# EAGLE design Rocketometer2148 MPU6050 (EAGLE 6.2)
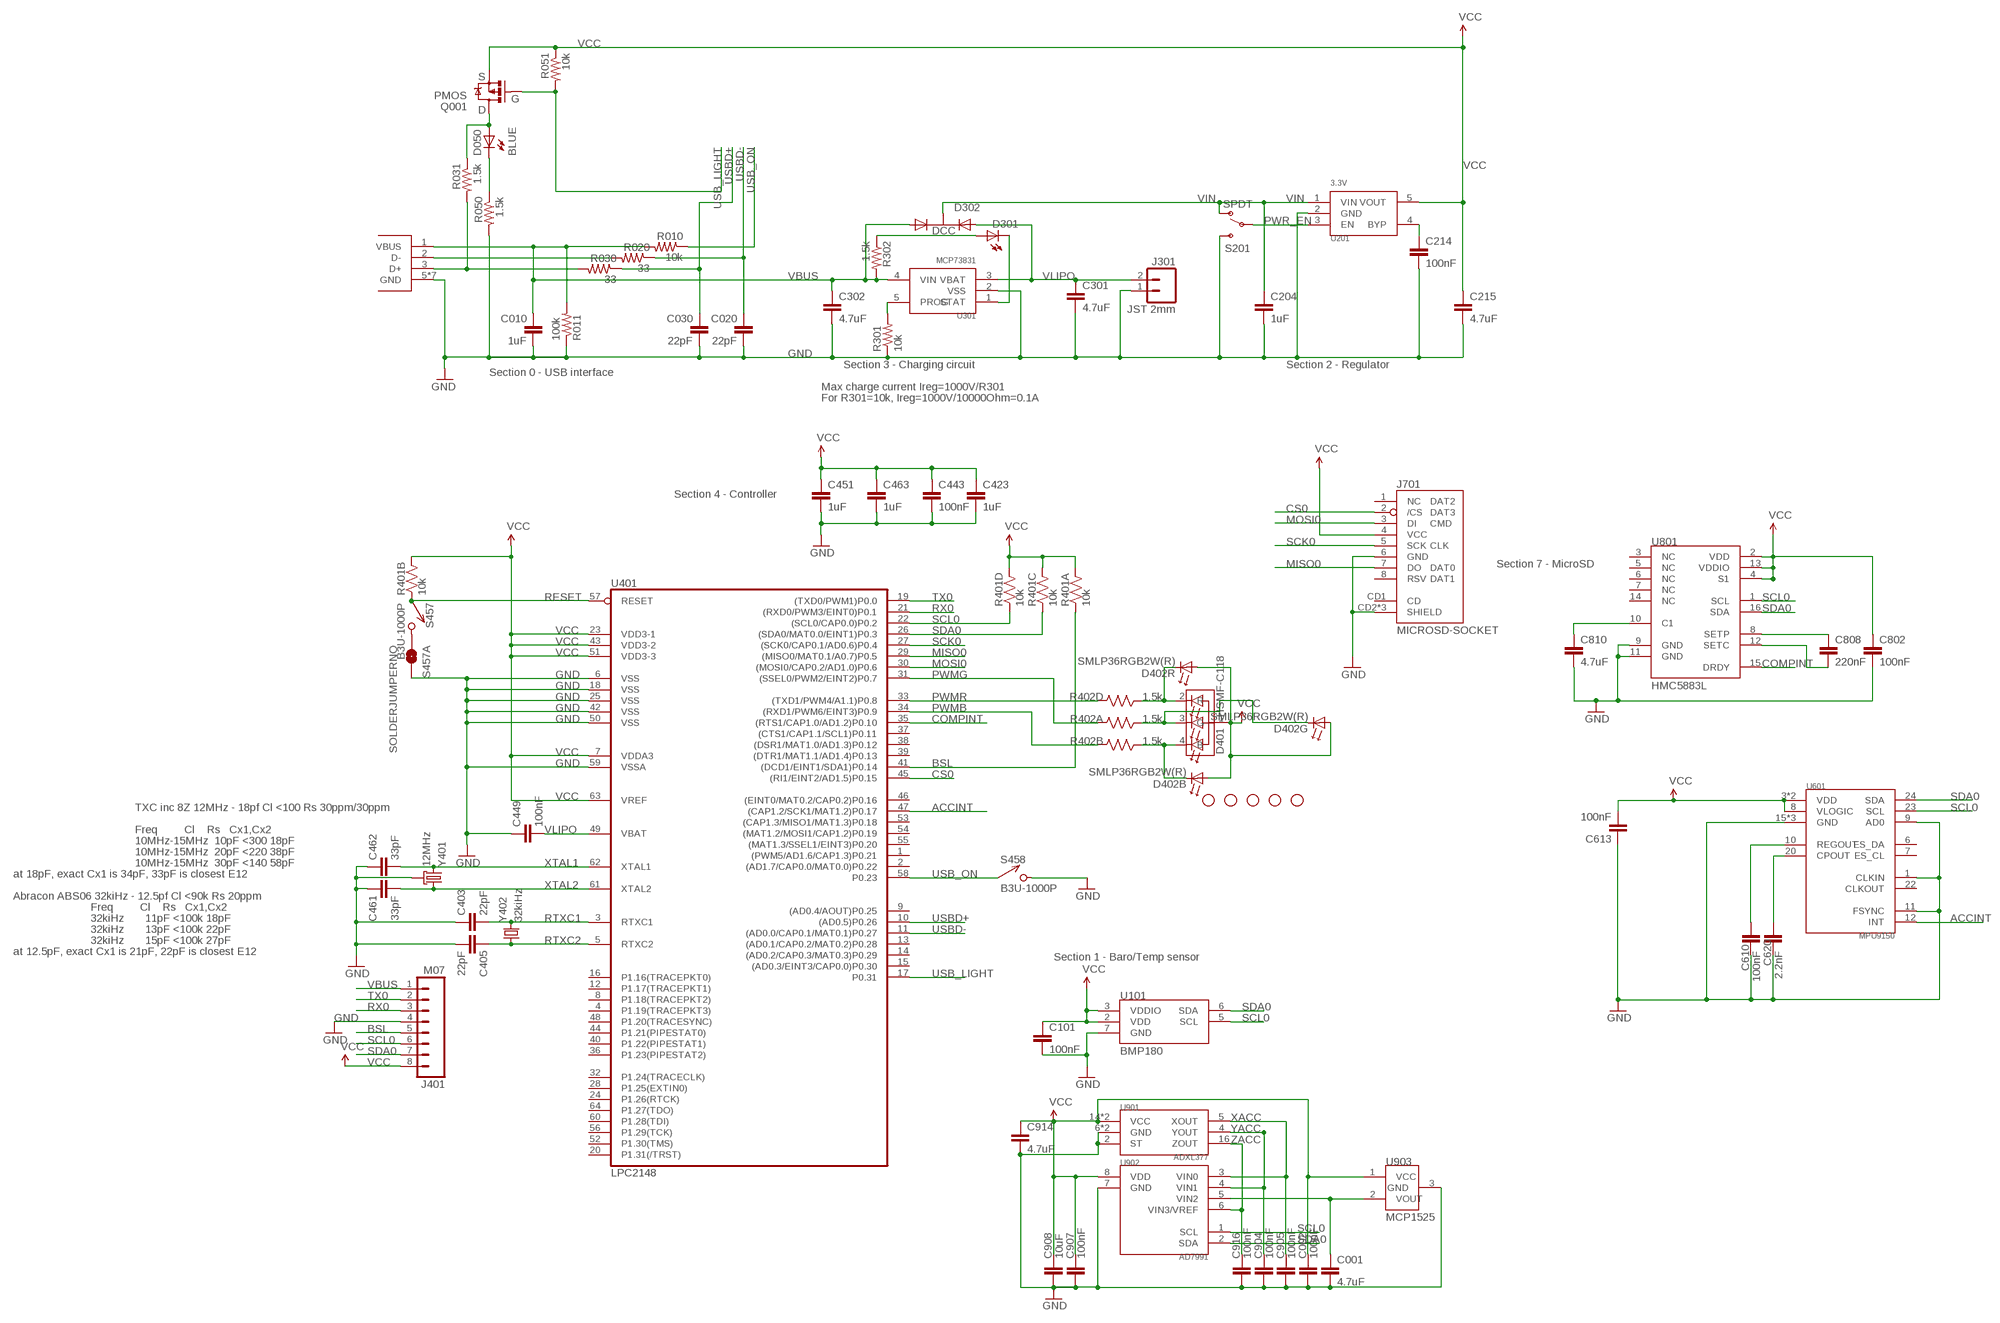
[diagram p0: schematic, sheet 1]

## Parts
C001  4.7uF  CAP0402-CAP  [0402-CAP]
C002  100nF  CAP0402-CAP  [0402-CAP]
C010  1uF  CAP0402-CAP  [0402-CAP]
C020  22pF  CAP0402-CAP  [0402-CAP]
C030  22pF  CAP0402-CAP  [0402-CAP]
C101  100nF  CAP0402-CAP  [0402-CAP]
C204  1uF  CAP0402-CAP  [0402-CAP]
C214  100nF  CAP0402-CAP  [0402-CAP]
C215  4.7uF  CAP0402-CAP  [0402-CAP]
C301  4.7uF  CAP0402-CAP  [0402-CAP]
C302  4.7uF  CAP0402-CAP  [0402-CAP]
C403  22pF  CAP0402-CAP  [0402-CAP]
C405  22pF  CAP0402-CAP  [0402-CAP]
C423  1uF  CAP0402-CAP  [0402-CAP]
C443  100nF  CAP0402-CAP  [0402-CAP]
C449  100nF  CAP0402-CAP  [0402-CAP]
C451  1uF  CAP0402-CAP  [0402-CAP]
C461  33pF  CAP0402-CAP  [0402-CAP]
C462  33pF  CAP0402-CAP  [0402-CAP]
C463  1uF  CAP0402-CAP  [0402-CAP]
C610  100nF  CAP0402-CAP  [0402-CAP]
C613  100nF  CAP0402-CAP  [0402-CAP]
C620  2.2nF  CAP0402-CAP  [0402-CAP]
C802  100nF  CAP0402-CAP  [0402-CAP]
C808  220nF  CAP0402-CAP  [0402-CAP]
C810  4.7uF  CAP0402-CAP  [0402-CAP]
C904  100nF  CAP0402-CAP  [0402-CAP]
C905  100nF  CAP0402-CAP  [0402-CAP]
C907  100nF  CAP0402-CAP  [0402-CAP]
C908  10uF  CAP0603-CAP  [0603-CAP]
C914  4.7uF  CAP0402-CAP  [0402-CAP]
C916  100nF  CAP0402-CAP  [0402-CAP]
D050  BLUE  LED0603  [LED-0603]
D301  YELLOW  LED0603  [LED-0603]
D302  DCC  PMEG2005CT  [SOT-23-3]
D401  HSMF-C118  [HSMF-C118]
D402  SMLP36RGB2W(R)  [SMLP36]
J001  USB_MICROB_JST  [UB-MC5BR3-SD204-4S]
J301  JST 2mm  M02-JST-2MM-SMT  [JST-2-SMD]
J401  M07  M081X08  [1X08]
J701  MICROSD-SOCKET  [MICROSD-SOCKET-PP]
JP1  STAND-OFFTIGHT  [STAND-OFF-TIGHT]
JP2  STAND-OFFTIGHT  [STAND-OFF-TIGHT]
JP3  STAND-OFFTIGHT  [STAND-OFF-TIGHT]
JP4  STAND-OFFTIGHT  [STAND-OFF-TIGHT]
JP5  STAND-OFFTIGHT  [STAND-OFF-TIGHT]
Q001  PMOS  MOSFET-PCHANNELSMD  [SOT23-3]
R010  10k  RESISTOR0402-RES  [0402-RES]
R011  100k  RESISTOR0402-RES  [0402-RES]
R020  33  RESISTOR0402-RES  [0402-RES]
R030  33  RESISTOR0402-RES  [0402-RES]
R031  1.5k  RESISTOR0402-RES  [0402-RES]
R050  1.5k  RESISTOR0402-RES  [0402-RES]
R051  10k  RESISTOR0402-RES  [0402-RES]
R301  10k  RESISTOR0402-RES  [0402-RES]
R302  1.5k  RESISTOR0402-RES  [0402-RES]
R401  10k  RP404  [CRA04]
R402  1.5k  RP404  [CRA04]
S201  SPDT  SWITCH-SPSTSMD  [AYZ0202]
S457  B3U-1000P  [B3U-1000P]
S457A  SOLDERJUMPERNO  [SJ_2S-NO]
S458  B3U-1000P  [B3U-1000P]
U101  BMP180  [BMP180]
U201  3.3V  MIC5319D5  [SOT-23-5]
U301  MCP73831  [SOT-23-5]
U401  LPC2148  LPC213X  [SQFP-S-10X10-64]
U601  MPU9150  [LLGA24]
U801  HMC5883L  HMC5883LSMD  [16LPCC]
U901  ADXL377  [ADXL377]
U902  AD7991  AD799X  [SOT-23-8]
U903  MCP1525  [SOT-23-3]
Y401  12MHz  CX2520  [CRYSTAL_SMD_2MM_2_5MM]
Y402  32kiHz  ABS06  [ABS06]

## Nets
ACCINT: U401.47((CAP1.2/SCK1/MAT1.2)P0.17) U601.12(INT)
BSL: J401.5 R401.1 U401.41((DCD1/EINT1/SDA1)P0.14)
COMPINT: U401.35((RTS1/CAP1.0/AD1.2)P0.10) U801.15(DRDY)
CONN_D+: J001.3(D+) R030.2 R031.2
CONN_D-: J001.2(D-) R020.2
CS0: J701.2(/CS) U401.45((RI1/EINT2/AD1.5)P0.15)
GND [power]: C001.2 C002.2 C010.2 C020.2 C030.2 C101.2 C204.2 C214.2 C215.2 C301.2 C302.2 C403.1 C405.2 C423.2 C443.2 C449.1 C451.2 C461.1 C462.1 C463.2 C610.2 C613.1 C620.1 C802.2 C810.2 C904.2 C905.2 C907.2 C908.2 C914.2 C916.2 J001.5(GND) J001.P$6(GND) J001.P$7(GND) J001.P$8(GND) J001.P$9(GND) J001.P$10(GND) J001.P$11(GND) J301.1 J401.4 J701.6(GND) J701.CD2(SHIELD) J701.GND1(SHIELD) J701.GND3(SHIELD) R011.1 R050.2 R301.1 S201.3(S) S457A.2 S458.P$2 U101.7(GND) U201.2(GND) U301.2(VSS) U401.6(VSS) U401.18(VSS) U401.25(VSS) U401.42(VSS) U401.50(VSS) U401.59(VSSA) U601.1(CLKIN) U601.9(AD0) U601.11(FSYNC) U601.15(GND) U601.17(GND) U601.18(GND) U801.9(GND) U801.11(GND) U901.2(ST) U901.6(GND) U901.7(GND) U902.7(GND) U903.3(GND) Y401.2(GND) Y401.4(GND)
MISO0: J701.7(DO) U401.29((MISO0/MAT0.1/A0.7)P0.5)
MOSI0: J701.3(DI) U401.30((MOSI0/CAP0.2/AD1.0)P0.6)
N$1: C620.2 U601.20(CPOUT)
N$2: R301.2 U301.5(PROG)
N$4: D301.C U301.1(STAT)
N$5: D301.A R302.1
N$6: D050.A Q001.3(D) R031.1
N$7: D050.C R050.1
N$8: S457.P$2 S457A.1
N$10: C001.1 U902.5(VIN2) U903.2(VOUT)
N$13: C610.1 U601.10(REGOUT)
N$14: C808.1 U801.8(SETP)
N$15: C808.2 U801.12(SETC)
N$16: C810.1 U801.10(C1)
N$17: C214.1 U201.4(BYP)
PWMB: R402.7 U401.34((RXD1/PWM6/EINT3)P0.9)
PWMG: R402.8 U401.31((SSEL0/PWM2/EINT2)P0.7)
PWMR: R402.5 U401.33((TXD1/PWM4/A1.1)P0.8)
PWR_EN: S201.2(P) U201.3(EN)
QWMB: D401.4(B) D402.1(B:C) R402.2
QWMG: D401.3(G) D402.5(G:C) R402.1
QWMR: D401.2(R) D402.3(R:C) R402.4
RESET [power]: R401.2 S457.P$1 U401.57(RESET)
RTXC1: C403.2 U401.3(RTXC1) Y402.2
RTXC2: C405.1 U401.5(RTXC2) Y402.1
RX0: J401.3 U401.21((RXD0/PWM3/EINT0)P0.1)
SCK0: J701.5(SCK) U401.27((SCK0/CAP0.1/AD0.6)P0.4)
SCL0: J401.6 R401.4 U101.5(SCL) U401.22((SCL0/CAP0.0)P0.2) U601.23(SCL) U801.1(SCL) U902.1(SCL)
SDA0: J401.7 R401.3 U101.6(SDA) U401.26((SDA0/MAT0.0/EINT1)P0.3) U601.24(SDA) U801.16(SDA) U902.2(SDA)
TX0: J401.2 U401.19((TXD0/PWM1)P0.0)
USB_LIGHT: Q001.1(G) R051.2 U401.17(P0.31)
USB_ON: R010.1 S458.P$1 U401.58(P0.23)
USBD+: C030.1 R030.1 U401.10((AD0.5)P0.26)
USBD-: C020.1 R020.1 U401.11((AD0.0/CAP0.1/MAT0.1)P0.27)
VBUS: C010.1 C302.1 D302.1(A1) J001.1(VBUS) J401.1 R010.2 R011.2 R302.2 U301.4(VIN)
VCC [power]: C002.1 C101.1 C215.1 C423.1 C443.1 C451.1 C463.1 C613.2 C802.1 C907.1 C908.1 C914.1 D401.1(A) D402.2(B:A) D402.4(R:A) D402.6(G:A) J401.8 J701.4(VCC) Q001.2(S) R051.1 R401.5 R401.6 R401.7 R401.8 U101.2(VDD) U101.3(VDDIO) U201.5(VOUT) U401.7(VDDA3) U401.23(VDD3-1) U401.43(VDD3-2) U401.51(VDD3-3) U401.63(VREF) U601.3(VDD) U601.8(VLOGIC) U601.13(VDD) U801.2(VDD) U801.4(S1) U801.13(VDDIO) U901.14(VCC) U901.15(VCC) U902.8(VDD) U903.1(VCC)
VIN: C204.1 D302.3(K) S201.1(O) U201.1(VIN)
VLIPO: C301.1 C449.2 D302.2(A2) J301.2 U301.3(VBAT) U401.49(VBAT)
XACC: C905.1 U901.5(XOUT) U902.3(VIN0)
XTAL1: C462.2 U401.62(XTAL1) Y401.3
XTAL2: C461.2 U401.61(XTAL2) Y401.1
YACC: C904.1 U901.4(YOUT) U902.4(VIN1)
ZACC: C916.1 U901.16(ZOUT) U902.6(VIN3/VREF)
Unconnected: J701.1(NC) J701.8(RSV) J701.CD1(CD) R402.3 R402.6 U401.1((PWM5/AD1.6/CAP1.3)P0.21) U401.2((AD1.7/CAP0.0/MAT0.0)P0.22) U401.4(P1.19(TRACEPKT3)) U401.8(P1.18(TRACEPKT2)) U401.9((AD0.4/AOUT)P0.25) U401.12(P1.17(TRACEPKT1)) U401.13((AD0.1/CAP0.2/MAT0.2)P0.28) U401.14((AD0.2/CAP0.3/MAT0.3)P0.29) U401.15((AD0.3/EINT3/CAP0.0)P0.30) U401.16(P1.16(TRACEPKT0)) U401.20(P1.31(/TRST)) U401.24(P1.26(RTCK)) U401.28(P1.25(EXTIN0)) U401.32(P1.24(TRACECLK)) U401.36(P1.23(PIPESTAT2)) U401.37((CTS1/CAP1.1/SCL1)P0.11) U401.38((DSR1/MAT1.0/AD1.3)P0.12) U401.39((DTR1/MAT1.1/AD1.4)P0.13) U401.40(P1.22(PIPESTAT1)) U401.44(P1.21(PIPESTAT0)) U401.46((EINT0/MAT0.2/CAP0.2)P0.16) U401.48(P1.20(TRACESYNC)) U401.52(P1.30(TMS)) U401.53((CAP1.3/MISO1/MAT1.3)P0.18) U401.54((MAT1.2/MOSI1/CAP1.2)P0.19) U401.55((MAT1.3/SSEL1/EINT3)P0.20) U401.56(P1.29(TCK)) U401.60(P1.28(TDI)) U401.64(P1.27(TDO)) U601.6(ES_DA) U601.7(ES_CL) U601.22(CLKOUT) U801.3(NC) U801.5(NC) U801.6(NC) U801.7(NC) U801.14(NC)

## Notes on the sheet
- S
- G
- D
- Section 0 - USB interface | Section 3 - Charging circuit | Section 2 - Regulator
- Max charge current Ireg=1000V/R301
- For R301=10k, Ireg=1000V/10000Ohm=0.1A
- Section 4 - Controller
- Section 7 - MicroSD
- TXC inc 8Z 12MHz - 18pf Cl <100 Rs 30ppm/30ppm
- Freq         Cl    Rs   Cx1,Cx2
- 10MHz-15MHz  10pF <300 18pF
- 10MHz-15MHz  20pF <220 38pF
- 10MHz-15MHz  30pF <140 58pF
- at 18pF, exact Cx1 is 34pF, 33pF is closest E12
- Abracon ABS06 32kiHz - 12.5pf Cl <90k Rs 20ppm
- Freq         Cl    Rs   Cx1,Cx2
- 32kiHz       11pF <100k 18pF
- 32kiHz       13pF <100k 22pF
- 32kiHz       15pF <100k 27pF
- at 12.5pF, exact Cx1 is 21pF, 22pF is closest E12
- Section 1 - Baro/Temp sensor

## Library data of the parts
C001 C215 C301 C302 C810 C914 = SparkFun:CAP: Capacitor Standard 0603 ceramic capacitor, and 0.1" leaded capacitor.; DIGIKEY: 445-7395-1-ND
C002 C907 = SparkFun-Passives:CAP: Capacitor Standard 0603 ceramic capacitor, and 0.1" leaded capacitor.; DIGIKEY: 445-1265-1-ND
C010 C204 C423 C451 C463 = SparkFun:CAP: Capacitor Standard 0603 ceramic capacitor, and 0.1" leaded capacitor.; DIGIKEY: 445-4114-1-ND
C020 C030 C403 C405 = SparkFun:CAP: Capacitor Standard 0603 ceramic capacitor, and 0.1" leaded capacitor.; DIGIKEY: 445-1239-1-ND
C101 C214 C443 C449 C610 C613 C802 C904 C905 C916 = SparkFun:CAP: Capacitor Standard 0603 ceramic capacitor, and 0.1" leaded capacitor.; DIGIKEY: 445-1265-1-ND
C461 C462 = SparkFun:CAP: Capacitor Standard 0603 ceramic capacitor, and 0.1" leaded capacitor.; DIGIKEY: 445-1241-1-ND
C620 = SparkFun:CAP: Capacitor Standard 0603 ceramic capacitor, and 0.1" leaded capacitor.; DIGIKEY: 445-1257-1-ND
C808 = SparkFun:CAP: Capacitor Standard 0603 ceramic capacitor, and 0.1" leaded capacitor.; DIGIKEY: 445-5938-1-ND
C908 = SparkFun:CAP: Capacitor Standard 0603 ceramic capacitor, and 0.1" leaded capacitor.; DIGIKEY: 445-7486-1-ND
D050 = SparkFun:LED: LEDs Standard schematic elements and footprints for 5mm, 3mm, 1206, and 0603 sized LEDs. 5mm - Spark Fun Electronics SKU : COM-00529 (and others); DIGIKEY: 350-2037-1-ND
D301 = SparkFun:LED: LEDs Standard schematic elements and footprints for 5mm, 3mm, 1206, and 0603 sized LEDs. 5mm - Spark Fun Electronics SKU : COM-00529 (and others); DIGIKEY: 350-2032-1-ND
D302 = KwanSystems:PMEG2005CT; DIGIKEY: 568-6500-1-ND
D401 = KwanSystems:HSMF-C118; DIGIKEY: 516-1778-1-ND
D402 = KwanSystems:SMLP36RGB2W(R)
J001 = KwanSystems:USB_MICROB_JST; DIGIKEY: 455-2562-1-ND
J301 = SparkFun:M02: Header 2 Standard 2-pin 0.1" header. Use with straight break away headers (SKU : PRT-00116), right angle break away headers (PRT-00553), swiss pins (PRT-00743), machine pins (PRT-00117), and female headers (PRT-00115). Molex polarized connector foot print use with SKU : PRT-08233 with associated crimp pins and housings.; DIGIKEY: 455-1749-1-ND
J401 = SparkFun-Connectors:M08: Header 8 Standard 8-pin 0.1" header. Use with straight break away headers (SKU : PRT-00116), right angle break away headers (PRT-00553), swiss pins (PRT-00743), machine pins (PRT-00117), and female headers (PRT-00115).; DIGIKEY: $NOPART
J701 = KwanSystems:MICROSD-SOCKET: microSD Socket Push-push type uSD socket. Digikey 101-00660-68-6-1-ND. tDoc lines correctly indicate media card edge positions when inserting (unlocked, locked, depressed).; DIGIKEY: 101-00581-59-1-ND
JP1-JP5 = SparkFun-Electromechanical:STAND-OFF: #4 Stand Off This is the mechanical footprint for a #4 phillips button head screw. Use the keepout ring to avoid running the screw head into surrounding components. SKU : PRT-00447; DIGIKEY: $NOPART
Q001 = SparkFun-DiscreteSemi:MOSFET-PCHANNEL: Generic PMOSFET
R010 R051 R301 = SparkFun:RESISTOR: Resistor Basic schematic elements and footprints for 0603, 1206, and PTH resistors.; DIGIKEY: P10.0KLCT-ND
R011 = SparkFun:RESISTOR: Resistor Basic schematic elements and footprints for 0603, 1206, and PTH resistors.; DIGIKEY: P100KLCT-ND
R020 R030 = SparkFun:RESISTOR: Resistor Basic schematic elements and footprints for 0603, 1206, and PTH resistors.; DIGIKEY: P33.0LCT-ND
R031 R050 R302 = SparkFun:RESISTOR: Resistor Basic schematic elements and footprints for 0603, 1206, and PTH resistors.; DIGIKEY: P1.50KLCT-ND
R401 = KwanSystems:RP4; DIGIKEY: CRA4S810KCT-ND
R402 = KwanSystems:RP4; DIGIKEY: CRA4S81.5KCT-ND
S201 = SparkFun:SWITCH-SPST: SPST Switch Simple slide switch. Spark Fun Electronics SKU : COM-00102; DIGIKEY: 401-2013-1-ND
S457 S458 = KwanSystems:B3U-1000P; DIGIKEY: SW1020CT-ND
S457A = SparkFun-Passives:SOLDERJUMPER: Solder Jumper Standard SMD solder jumper. Used to automate production. Two varients : Normally Open and Normally Closed are the same, but have different paste layers. NC will have a large amount of paste and should jumper during reflow.; DIGIKEY: $NOPART
U101 = KwanSystems:BMP180; DIGIKEY: 828-1027-1-ND
U201 = KwanSystems:MIC5319; DIGIKEY: 576-1910-1-ND
U301 = KwanSystems:MCP73831; DIGIKEY: 576-1910-1-ND
U401 = SparkFun:LPC213X: LPC213x Schematic element and footprint for NXP LPC213x. Spark Fun Electronics SKU : COM-00520; DIGIKEY: 568-1765-ND
U601 = KwanSystems:MPU9150
U801 = SparkFun:HMC5883L: 3 Axis Digital Compass IC; DIGIKEY: 342-1082-1-ND; LABEL_3D50: 5883
U901 = KwanSystems:ADXL377; DIGIKEY: ADXL377BCPZ-RL7CT-ND
U902 = KwanSystems:AD799X; DIGIKEY: AD7991YRJZ-0500RL7CT-ND
U903 = KwanSystems:MCP1525
Y401 = KwanSystems:CX2520; DIGIKEY: 887-1487-1-ND
Y402 = KwanSystems:ABS06; DIGIKEY: 535-10104-1-ND

## Net classes
0 default: width 0.152 mm, drill 0.33 mm, clearance 0.152 mm
1 power: width 0.152 mm, drill 0.33 mm, clearance 0.152 mm to class 0, clearance 0.152 mm
2 hv: width 0.152 mm, drill 0.33 mm, clearance 0.152 mm to class 0, clearance 0.152 mm to class 1, clearance 0.152 mm

## Board
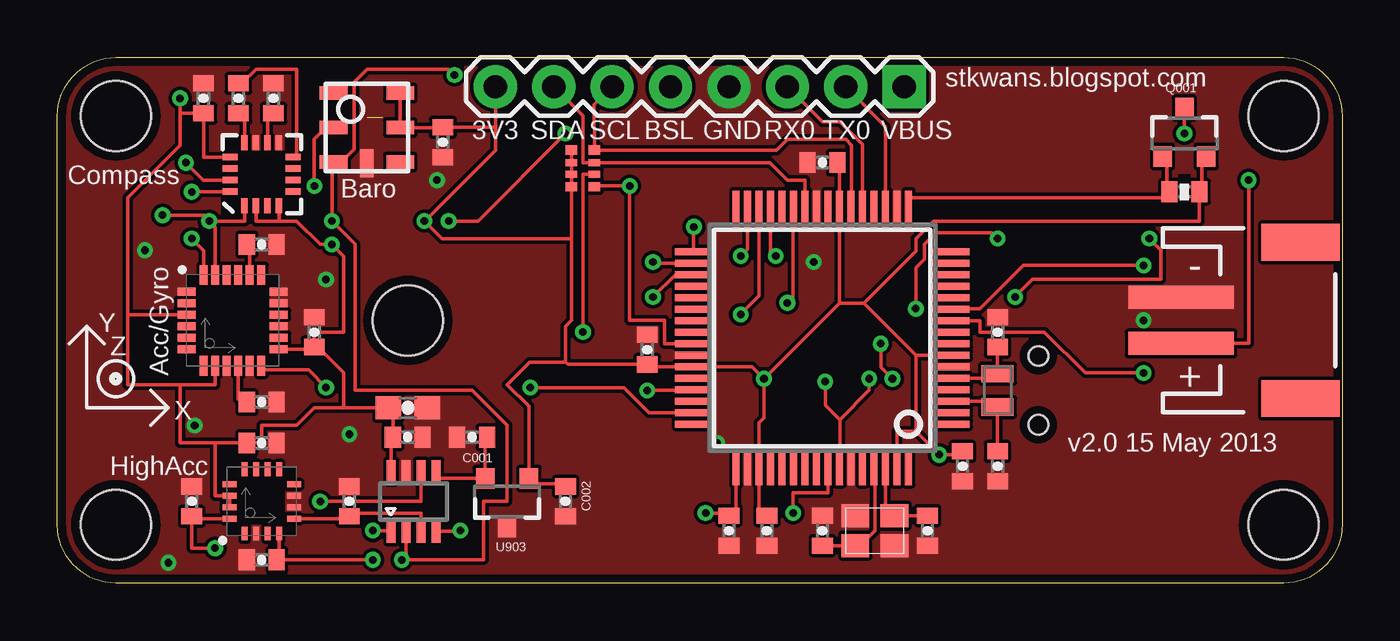
[diagram p1: board, top side]
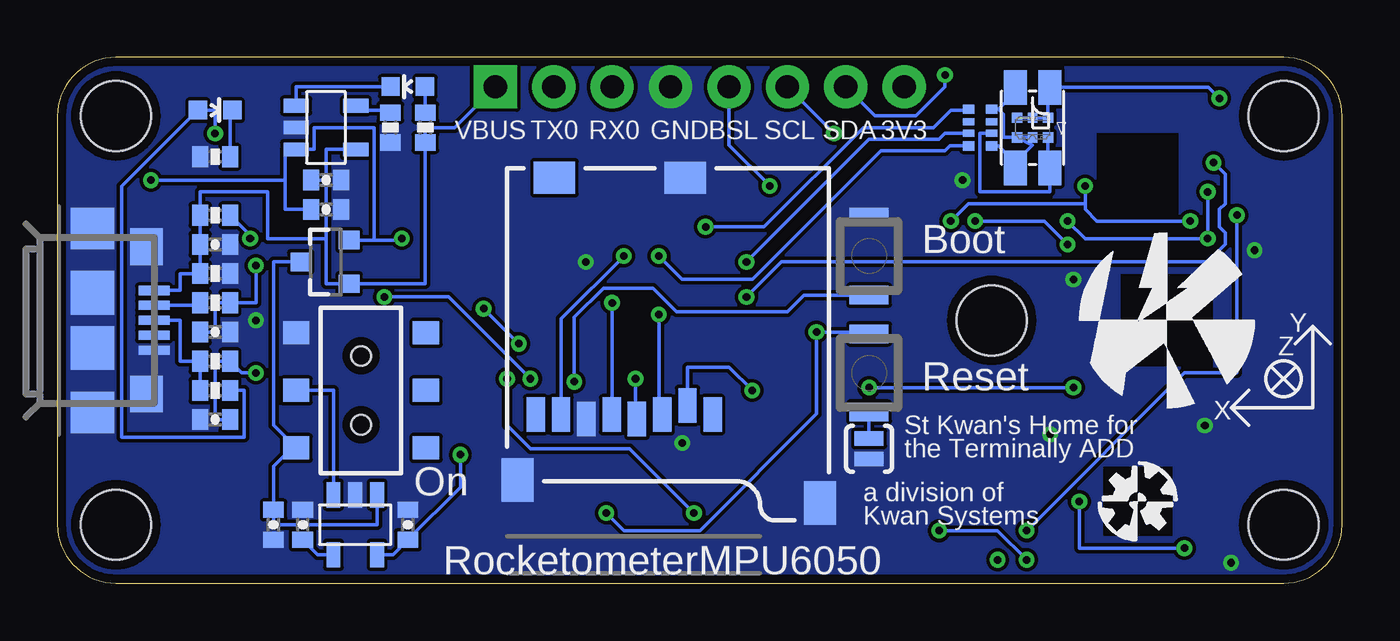
[diagram p2: board, bottom side, seen from below]

Size 55.88 x 22.86 mm. Coordinates in mm from the lower left corner, seen from the top.
Outline: 2.54,22.86 53.34,22.86 arc-90 55.88,20.32 55.88,2.54 arc-90 53.34,0 2.54,0 arc-90 0,2.54 0,20.32 arc-90 2.54,22.86
Copper layers (1*16): Top 0.0356mm / dielectric 1.5011mm / Bottom 0.0356mm
Design rules: minimum track width 6mil, minimum drill 13mil, track to track 6mil, track to pad 6mil, pad to pad 6mil, via to via 6mil, smd to smd 6mil, copper to edge 15mil, drill to drill 6mil, minimum pad ring 7mil, minimum via ring 7mil, stop-mask expansion 4mil, vias tented up to drill 14mil, thermal gap 10mil
tRestrict: area 7.9,16.8 to 9.9,18.8; area 9.9,18.8 to 10.7,19.6; area 9.9,16 to 10.7,16.8; area 7.1,18.8 to 7.9,19.6; area 7.1,16 to 7.9,16.8; area 48.8,17.5 to 49.3,17.8
bRestrict: area 7.1,16 to 10.7,19.6

### Footprints (pad centres in the part's own frame; a part is rotated, then mirrored left to right if it is on the bottom)
0402-CAP = smd 0.7 x 0.9: 1 -0.65,0; 2 0.65,0
0603-CAP = smd 1.1 x 1: 1 -0.85,0; 2 0.85,0
LED-0603 = smd 0.8 x 0.8: A 0,-0.75; C 0,0.75
SOT-23-3 = smd 0.9 x 0.8: 1 -1,0.95; 2 -1,-0.95; 3 1.1,0
HSMF-C118 = smd 1.5 x 1: 1 1.75,-0.75; 2 1.75,0.75; 3 -1.75,0.75; 4 -1.75,-0.75
SMLP36 = smd 0.45 x 0.45: 1 -0.675,0.425; 2 -0.675,-0.425; 5 0.675,0.425; 6 0.675,-0.425 | smd 0.4 x 0.45: 3 0,0.425; 4 0,-0.425
UB-MC5BR3-SD204-4S = smd 0.4 x 1.35: 1 -1.3,2.675; 2 -0.65,2.675; 3 0,2.675; 4 0.65,2.675; 5 1.3,2.675 | smd 1.8 x 1.9: P$6 4,0; P$7 -4,0 | smd 1.9 x 1.9: P$8 -1.2,0; P$9 1.2,0 | smd 1.6 x 1.4: P$10 -3.2,2.35; P$11 3.2,2.35
JST-2-SMD = smd 1 x 4.6: 1 -1,-3.7; 2 1,-3.7 | smd 1.6 x 3.4: NC1 -3.4,1.5; NC2 3.4,1.5
1X08 = drill 1.016 pad 1.88 square: 1 0,0 | drill 1.016 pad 1.88: 2 2.54,0; 3 5.08,0; 4 7.62,0; 5 10.16,0; 6 12.7,0; 7 15.24,0; 8 17.78,0
MICROSD-SOCKET-PP = smd 0.8 x 1.5: 1 -8.94,10.7; 2 -7.84,10.3; 3 -6.74,10.7; 4 -5.64,10.9; 5 -4.54,10.7; 6 -3.44,10.9; 7 -2.34,10.7; 8 -1.24,10.7 | smd 1.8 x 1.4: CD1 -2.05,0.4; CD2 -7.75,0.4 | smd 1.4 x 1.9: GND1 -13.6,14.55; GND3 -0.45,13.55
STAND-OFF-TIGHT = hole 3.048: 0,0
SOT23-3 = smd 0.8 x 0.9: 1 -0.95,-1; 2 0.95,-1; 3 0,1.1
0402-RES = smd 0.7 x 0.9: 1 -0.65,0; 2 0.65,0
CRA04 = smd 0.4 x 0.5: 1 -0.8,-0.5; 4 0.8,-0.5; 5 0.8,0.5; 8 -0.8,0.5 | smd 0.3 x 0.5: 2 -0.25,-0.5; 3 0.25,-0.5; 6 0.25,0.5; 7 -0.25,0.5
AYZ0202 = smd 1 x 1.15: 1 -2.5,2.825; 2 0,2.825; 3 2.5,2.825; 4 -2.5,-2.825; 5 0,-2.825; 6 2.5,-2.825 | hole 0.85: 1.5,0; -1.5,0
B3U-1000P = smd 0.8 x 1.7: P$1 -1.7,0; P$2 1.7,0
SJ_2S-NO = smd 0.635 x 1.27: 1 -0.45,0; 2 0.45,0
BMP180 = smd 0.6 x 1.2: 1 1.5,1.45; 2 0,1.45; 3 -1.5,1.45; 4 -1.5,-1.45; 5 0,-1.45; 6 1.5,-1.45 | smd 1.2 x 0.6: 7 1.55,0
SOT-23-5 = smd 0.6 x 1.1: 1 -0.95,-1.3; 2 0,-1.3; 3 0.95,-1.3; 4 0.95,1.3; 5 -0.95,1.3
SQFP-S-10X10-64 = smd 0.3 x 1.6: 1 -3.75,-5.6; 2 -3.25,-5.6; 3 -2.75,-5.6; 4 -2.25,-5.6; 5 -1.75,-5.6; 6 -1.25,-5.6; 7 -0.75,-5.6; 8 -0.25,-5.6; 9 0.25,-5.6; 10 0.75,-5.6; 11 1.25,-5.6; 12 1.75,-5.6; 13 2.25,-5.6; 14 2.75,-5.6; 15 3.25,-5.6; 16 3.75,-5.6; 33 3.75,5.6; 34 3.25,5.6; 35 2.75,5.6; 36 2.25,5.6; 37 1.75,5.6; 38 1.25,5.6; 39 0.75,5.6; 40 0.25,5.6; 41 -0.25,5.6; 42 -0.75,5.6; 43 -1.25,5.6; 44 -1.75,5.6; 45 -2.25,5.6; 46 -2.75,5.6; 47 -3.25,5.6; 48 -3.75,5.6 | smd 1.6 x 0.3: 17 5.6,-3.75; 18 5.6,-3.25; 19 5.6,-2.75; 20 5.6,-2.25; 21 5.6,-1.75; 22 5.6,-1.25; 23 5.6,-0.75; 24 5.6,-0.25; 25 5.6,0.25; 26 5.6,0.75; 27 5.6,1.25; 28 5.6,1.75; 29 5.6,2.25; 30 5.6,2.75; 31 5.6,3.25; 32 5.6,3.75; 49 -5.6,3.75; 50 -5.6,3.25; 51 -5.6,2.75; 52 -5.6,2.25; 53 -5.6,1.75; 54 -5.6,1.25; 55 -5.6,0.75; 56 -5.6,0.25; 57 -5.6,-0.25; 58 -5.6,-0.75; 59 -5.6,-1.25; 60 -5.6,-1.75; 61 -5.6,-2.25; 62 -5.6,-2.75; 63 -5.6,-3.25; 64 -5.6,-3.75
LLGA24 = smd 0.8 x 0.35: 1 -2,1.25; 2 -2,0.75; 3 -2,0.25; 4 -2,-0.25; 5 -2,-0.75; 6 -2,-1.25; 13 2,-1.25; 14 2,-0.75; 15 2,-0.25; 16 2,0.25; 17 2,0.75; 18 2,1.25 | smd 0.35 x 0.85: 7 -1.25,-1.975; 8 -0.75,-1.975; 9 -0.25,-1.975; 10 0.25,-1.975; 11 0.75,-1.975; 12 1.25,-1.975; 19 1.25,1.975; 20 0.75,1.975; 21 0.25,1.975; 22 -0.25,1.975; 23 -0.75,1.975; 24 -1.25,1.975
16LPCC = smd 0.65 x 0.28: 1 -1.37,0.75; 2 -1.37,0.25; 3 -1.37,-0.25; 4 -1.37,-0.75; 9 1.37,-0.75; 10 1.37,-0.25; 11 1.37,0.25; 12 1.37,0.75 | smd 0.28 x 0.65: 5 -0.75,-1.37; 6 -0.25,-1.37; 7 0.25,-1.37; 8 0.75,-1.37; 13 0.75,1.37; 14 0.25,1.37; 15 -0.25,1.37; 16 -0.75,1.37
ADXL377 = smd 0.6 x 0.25: 1 -1.4,0.75; 2 -1.4,0.25; 3 -1.4,-0.25; 4 -1.4,-0.75; 9 1.4,-0.75; 10 1.4,-0.25; 11 1.4,0.25; 12 1.4,0.75 | smd 0.25 x 0.6: 5 -0.75,-1.4; 6 -0.25,-1.4; 7 0.25,-1.4; 8 0.75,-1.4; 13 0.75,1.4; 14 0.25,1.4; 15 -0.25,1.4; 16 -0.75,1.4
SOT-23-8 = smd 0.4 x 1: 1 -0.975,-1.3; 2 -0.325,-1.3; 3 0.325,-1.3; 4 0.975,-1.3; 5 0.975,1.3; 6 0.325,1.3; 7 -0.325,1.3; 8 -0.975,1.3
CRYSTAL_SMD_2MM_2_5MM = smd 1.2 x 1: 1 -0.85,-0.65; 2 0.85,-0.65; 3 0.85,0.65; 4 -0.85,0.65
ABS06 = smd 0.75 x 1.4: 1 -0.725,0; 2 0.725,0

### Placement (x,y rotation side)
C001  18.03,6.35 180 top
C002  22.1,3.56 270 top
C010  49.02,14.73 0 bottom
C020  49.02,10.92 0 bottom
C030  49.02,7.11 180 bottom
C101  16.76,19.18 270 top
C204  46.48,2.54 270 bottom
C214  45.21,2.54 90 bottom
C215  40.64,2.54 90 bottom
C301  44.2,16.26 0 bottom
C302  44.2,17.53 0 bottom
C403  40.89,5.08 90 top
C405  40.89,10.92 90 top
C423  33.27,18.29 180 top
C443  25.65,10.16 90 top
C449  29.21,2.29 90 top
C451  30.86,2.29 270 top
C461  33.27,2.29 270 top
C462  37.85,2.29 90 top
C463  39.37,5.08 270 top
C610  8.89,7.87 0 top
C613  11.18,10.92 270 top
C620  8.89,14.73 180 top
C802  6.35,21.08 90 top
C808  7.87,21.08 270 top
C810  9.4,21.08 90 top
C904  8.89,1.02 180 top
C905  12.7,3.56 90 top
C907  15.24,6.35 0 top
C908  15.24,7.62 0 top
C914  8.89,6.1 0 top
C916  5.84,3.56 90 top
D050  49.02,20.57 270 bottom
D301  40.64,21.59 90 bottom
D302  44.2,13.97 180 bottom
D401  13.46,19.81 90 bottom
D402  13.46,19.81 180 bottom
J001  54.36,11.43 270 bottom
J301  52.58,11.43 270 top
J401  36.83,21.59 180 top
J701  36.31,18.03 180 bottom
JP1  2.54,2.54 0 top
JP2  2.54,20.32 0 top
JP3  15.24,11.43 0 top
JP4  53.34,2.54 0 top
JP5  53.34,20.32 0 top
Q001  49.02,19.56 0 top
R010  49.02,16 180 bottom
R011  49.02,13.46 180 bottom
R020  49.02,12.19 180 bottom
R030  49.02,9.65 180 bottom
R031  49.02,8.38 180 bottom
R050  49.02,18.54 180 bottom
R051  49.02,17.02 180 top
R301  41.4,19.81 90 bottom
R302  39.88,19.81 270 bottom
R401  22.86,18.03 90 top
R402  15.75,19.81 90 bottom
S201  42.67,8.38 90 bottom
S457  20.57,9.14 270 bottom
S457A  20.57,5.84 270 bottom
S458  20.57,14.22 90 bottom
U101  13.46,19.81 270 top
U201  42.93,2.54 180 bottom
U301  44.2,19.81 270 bottom
U401  33.27,10.67 90 top
U601  7.62,11.43 0 top
U801  8.89,17.78 90 top
U901  8.89,3.56 90 top
U902  15.49,3.56 0 top
U903  19.56,3.56 270 top
U$4  [AXES]  1.27,7.62 0 top
U$5  [KWAN_ACC]  7.62,11.43 0 bottom
U$6  [OSHW_ACC]  8.89,3.56 0 bottom
Y401  35.56,2.29 0 top
Y402  40.89,8.38 270 top

### Tracks (layer width: path | path; a pad name or v marks a point on that pad's centre or on a via)
ACCINT  (via drill 0.33)
  Top 0.152: U401.47 25.73,7.42 24.64,8.51 v20.57,8.51 | U601.12 8.87,9.27 10.92,9.27 v11.68,8.51
  Bottom 0.152: v20.57,8.51 v11.68,8.51
BSL  (via drill 0.33)
  Top 0.152: R401.1 23.37,17.27 v24.89,17.27 24.89,11.43 26.42,11.43 26.42,10.42 U401.41
  Bottom 0.152: J401.5 26.67,19.05 v24.89,17.27
COMPINT  (via drill 0.33)
  Top 0.152: U801.15 6.35,17.53 v5.59,18.29 | v25.91,12.45 26.88,13.42 U401.35
  Bottom 0.152: v5.59,18.29 5.08,17.78 5.08,16.51 5.33,16.26 5.33,15.49 5.08,15.24 5.08,14.73 5.84,13.97 24.38,13.97 v25.91,12.45
CONN_D+
  Bottom 0.152: J001.3 50.55,11.43 50.55,9.65 R030.2 R031.2
CONN_D-
  Bottom 0.152: J001.2 49.67,12.08 R020.2
CS0  (via drill 0.33)
  Top 0.152: U401.45 27.64,8.38 v25.65,8.38
  Bottom 0.152: v25.65,8.38 26.67,9.4 28.47,9.4 J701.2
GND  (via drill 0.33)
  other vias: 47.24,11.43 16.51,17.53 3.81,14.48 12.7,6.48 11.68,13.21 5.97,6.86 32.89,13.97 4.83,0.89 28.7,6.1
  pour Top (no thermals): 2.54,22.86 53.34,22.86 arc-90 55.88,20.32 55.88,2.54 arc-90 53.34,0 2.54,0 arc-90 0,2.54 0,20.32 arc-90
  pour Bottom (no thermals): 2.54,22.86 53.34,22.86 arc-90 55.88,20.32 55.88,2.54 arc-90 53.34,0 2.54,0 arc-90 0,2.54 0,20.32 arc-90
MISO0  (via drill 0.33)
  Top 0.152: U401.29 31.02,14.44 v31.24,14.22
  Bottom 0.152: v31.24,14.22 33.97,11.49 J701.7
MOSI0  (via drill 0.33)
  Top 0.152: U401.30 30.52,12.49 v29.72,11.68
  Bottom 0.152: J701.3 29.72,7.48 v29.72,11.68
N$1
  Top 0.152: U601.20 8.37,14.6 C620.2
N$2
  Bottom 0.152: U301.5 42.71,20.57 41.4,20.57 R301.2
N$4
  Bottom 0.152: D301.C 45.5,21.59 U301.1
N$5
  Bottom 0.152: D301.A 39.88,21.59 R302.1
N$6  (via drill 0.33)
  Top 0.152: Q001.3 v49.02,19.56
  Bottom 0.152: v49.02,19.56 49.02,20.57 D050.A 53.09,17.26 53.09,6.35 47.75,6.35 47.75,8.38 R031.1
N$7
  Bottom 0.152: D050.C arc-90 48.37,20.47 R050.1
N$8
  Bottom 0.152: S457.P$2 S457A.1
N$10
  Top 0.152: U902.5 16.47,4.56 U903.2 18.61,6.35 C001.1
N$13
  Top 0.152: C610.1 7.87,7.99 U601.10
N$14
  Top 0.152: C808.1 8.02,21.73 8.64,22.35 10.41,22.35 10.41,18.53 U801.8
N$15
  Top 0.152: U801.12 8.14,20.17 C808.2
N$16
  Top 0.152: U801.10 9.14,20.17 C810.1
N$17
  Bottom 0.152: U201.4 44.56,1.24 C214.1
PWMB  (via drill 0.33)
  Top 0.152: U401.34 25.96,13.92 v25.91,13.97
  Bottom 0.152: v25.91,13.97 20.57,19.3 17.53,19.3 17.27,19.56 R402.7
PWMG  (via drill 0.33)
  Top 0.152: v29.72,14.22 30.02,14.53 U401.31
  Bottom 0.152: R402.8 17.06,19.01 17.27,18.8 20.07,18.8 25.65,13.21 28.7,13.21 v29.72,14.22
PWMR  (via drill 0.33)
  Top 0.152: U401.33 27.67,15.49 v27.69,15.49
  Bottom 0.152: v27.69,15.49 25.15,15.49 20.83,19.81 17.78,19.81 17.02,20.57 16.26,20.57 R402.5
PWR_EN
  Bottom 0.152: U201.3 43.88,8.38 S201.2
QWMB
  Bottom 0.152: D402.1 12.79,18.54 12.95,18.54 12.95,18.3 D401.4 12.7,17.02 15.75,17.02 15.75,19.56 R402.2
QWMG
  Bottom 0.152: D402.5 13.46,19.05 14.21,18.3 D401.3 14.73,18.8 14.95,19.01 R402.1
QWMR
  Bottom 0.152: 15.23,20.57 R402.4 14.95,20.61 | 14.95,20.61 14.21,21.35 D401.2 | 14.95,20.61 14.73,20.4 14.73,19.39 D402.3
RESET  (via drill 0.33)
  Top 0.152: R401.2 22.86,17.78 v22.86,10.92 | U401.57 33.52,3.94 32,3.94 v32,3.05
  Bottom 0.152: S457.P$1 20.65,10.92 v22.86,10.92 22.86,7.37 27.94,2.29 31.24,2.29 v32,3.05
RTXC1
  Top 0.152: U401.3 40.63,7.92 Y402.2 C403.2
RTXC2
  Top 0.152: U401.5 40.7,8.92 Y402.1 C405.1
RX0
  Top 0.152: U401.21 35.02,19.08 34.04,20.07 33.27,20.07 J401.3
SCK0  (via drill 0.33)
  Top 0.152: U401.27 32,16.25 32,12.45 v31.75,12.19
  Bottom 0.152: v31.75,12.19 31.75,7.33 J701.5
SCL0  (via drill 0.33)
  Top 0.152: J401.6 23.34,20.8 R401.4 31.28,18.83 31.75,19.3 34.29,19.3 34.54,19.05 34.54,16.29 U401.22 | U101.5 11.68,19.81 11.18,19.3 v11.18,17.27 | v6.6,15.75 8.14,15.75 U801.1 | v22.1,19.56 18.29,15.75 v17.02,15.75 | U902.1 14.49,2.29 v13.72,2.29 | v6.6,15.75 6.87,15.48 U601.23 | v4.57,16 6.35,16 v6.6,15.75
  Bottom 0.152: J401.6 v22.1,19.56 | v6.6,15.75 10.67,15.75 11.18,16.26 11.18,16.51 | v13.72,2.29 6.86,9.14 4.57,9.14 v4.57,16 | 11.18,16.51 v11.18,17.27 | v17.02,15.75 16.26,16.51 11.18,16.51
SDA0  (via drill 0.33)
  Top 0.152: J401.7 22.86,20.32 22.86,18.29 23.34,18.29 R401.3 30.99,18.28 31.75,17.53 32.52,17.53 U401.26 | v17.27,22.1 17.02,22.35 13.46,22.35 12.9,21.79 12.9,18.87 12.34,18.31 U101.6 | U101.6 12.22,18.31 | v5.84,17.02 5.85,17.03 U801.16 | U902.2 15.17,1.2 v14.99,1.02 18.54,1.02 18.54,3.56 19.56,3.56 19.56,6.86 18.03,8.38 12.95,8.38 12.95,14.73 v11.94,15.75 11.94,18.31 U101.6 | U601.24 6.37,14.46 v5.84,14.99
  Bottom 0.152: J401.7 20.32,20.32 18.54,20.32 17.27,21.59 v17.27,22.1 | v11.94,15.75 11.18,14.99 v5.84,14.99 v5.84,17.02
TX0
  Top 0.152: U401.19 36.02,19.86 J401.2
USB_LIGHT
  Top 0.152: 48.26,18.56 48.26,17.02 R051.2 48.37,16.76 37.02,16.76 U401.17
  Top 0.406: 48.26,18.56 Q001.1
USB_ON  (via drill 0.33)
  Top 0.152: v35.31,8.89 35.31,8.38 34.04,7.11 | 34.04,7.11 34.04,5.08 U401.58 | v47.5,14.99 48.01,14.48 48.01,13.21 42.42,13.21 v41.66,12.45 | 34.04,7.11 33.4,7.75 v33.4,8.76
  Bottom 0.152: v35.31,8.89 38.86,12.45 v41.66,12.45 | v33.4,8.76 33.4,11.56 32.13,12.83 29.97,12.83 28.96,11.81 24.13,11.81 23.42,12.52 S458.P$1 | R010.1 47.5,15.13 v47.5,14.99
USBD+  (via drill 0.33)
  Top 0.152: v47.24,9.14 44.7,9.14 42.93,10.92 40.13,10.92 40.13,11.42 U401.10
  Bottom 0.152: C030.1 49.02,7.11 49.02,9.65 R030.1 47.86,9.14 v47.24,9.14
USBD-  (via drill 0.33)
  Top 0.152: 38.87,11.94 U401.11 39.12,11.94 40.13,11.94 42.01,13.82 v47.24,13.82
  Bottom 0.152: R020.1 49.02,12.19 49.02,10.92 C020.1 | 48.37,11.94 R020.1 | R020.1 47.24,12.19 v47.24,13.82
VBUS
  Bottom 0.152: J001.1 50.55,12.73 50.55,13.46 R011.2 C010.1 R010.2 49.67,17.02 46.74,17.02 46.74,14.99 44.2,14.99 | J401.1 38.61,19.81 39.88,19.81 R302.2 39.88,13.02 D302.1 44.2,13.02 44.2,14.99 | 44.2,17.53 44.2,18.86 U301.4 | C302.1 44.2,17.53 | 44.2,17.53 44.2,14.99
VCC  (via drill 0.33)  (1 unrouted)
  Top 0.152: R401.5 R401.6 R401.7 R401.8 22.36,14.99 | C423.1 34.02,18.19 U401.23 34.02,12.18 | C451.1 30.52,3.27 U401.51 30.52,6.98 30.73,7.19 v30.73,8.89 | 49.78,18.37 49.78,17.02 R051.1 49.67,15.75 38.1,15.75 37.34,14.99 37.34,14.44 35.08,12.18 | U101.2 16.75,19.81 C101.1 | U101.2 U101.3 arc-90 14.94,21.34 | C101.1 16.78,19.83 | U902.8 14.52,6.28 C907.1 14.59,7.42 C908.1 12.45,7.62 | U601.8 6.87,8.64 5.33,8.64 | 6.87,6.1 C914.1 8.89,6.1 8.89,6.86 10.41,6.86 11.18,7.62 12.45,7.62 | 6.87,6.1 6.87,3.81 U901.14 U901.15 | U801.2 8.64,15.75 9.64,15.75 | 9.64,15.75 U801.4 | v5.33,21.08 5.33,20.43 | 5.33,20.43 C802.1 6.35,18.53 U801.13 | 19.05,19.83 19.05,18.83 v15.96,15.75 16.73,14.99 22.36,14.99 | 19.05,19.83 J401.8 | C101.1 19.05,19.83 | 9.64,15.75 10.41,15.75 11.43,14.73 v11.94,14.73 12.45,14.22 12.45,10.92 11.18,10.92 C613.2 | v30.73,8.89 30.21,9.42 U401.43 25.65,9.42 C443.1 22.2,9.51 22.1,9.61 | v30.73,8.89 34.02,12.18 | C463.1 arc-90 39.48,5.59 v38.35,5.59 37.34,6.6 | 37.34,6.6 36.52,6.6 U401.63 | 37.34,6.6 37.34,9.92 | 37.34,9.92 U401.7 | 37.34,9.92 35.08,12.18 | 35.08,12.18 34.02,12.18 | U101.2 14.61,19.81 | 22.36,14.99 22.36,11.44 22.1,11.18 22.1,9.61 | 5.33,20.43 5.33,19.05 3.05,16.76 3.05,11.68 | 3.05,11.68 3.05,8.64 5.33,8.64 | U601.13 11.08,10.18 arc90 C613.2 | C613.2 11.32,10.27 12.45,9.14 12.45,7.62 | 6.87,6.1 5.33,6.1 5.33,8.64 | U601.3 3.05,11.68 | C002.1 21.99,4.32 20.83,4.32 20.59,4.56 U903.1 20.51,7.69 19.56,8.64 20.54,9.61 22.1,9.61
  Top 0.406: Q001.2 49.78,18.56 49.78,18.37
  Bottom 0.152: U201.5 41.29,1.24 C215.1 38.35,4.18 v38.35,5.59 | v30.73,8.89 30.73,7.19 J701.4 | v5.33,21.08 5.81,21.56 D401.1 12.71,21.32 12.79,21.32 D402.2 D402.6 | v11.94,14.73 12.95,15.75 v15.96,15.75
VIN
  Bottom 0.152: U201.1 41.98,2.54 46.48,2.54 C204.1 46.48,5.08 45.68,5.88 S201.1 46.47,6.86 46.48,6.86 46.48,13.97 D302.3
VLIPO  (via drill 0.33)
  Top 0.152: U401.49 29.52,3.25 C449.2 29.21,3.05 v28.19,3.05 | J301.2 51.82,10.43 v51.82,17.53 | v35.81,10.41 35.81,9.4 v36.32,8.89 | v37.34,11.94 37.34,13.72 37.72,14.1 37.72,14.73 38.23,15.24 40.64,15.24 v40.89,14.99
  Bottom 0.152: C301.1 45.97,16.26 45.97,17.53 | 45.97,17.53 45.97,18.86 U301.3 44.7,18.86 44.7,19.81 42.11,19.81 42.11,14.92 | 42.11,14.92 D302.2 | v51.82,17.53 45.97,17.53 | v35.81,10.41 v37.34,11.94 | v36.32,8.89 36.32,6.86 35.31,5.84 30.99,5.84 v28.19,3.05 | v40.89,14.99 40.96,14.92 42.11,14.92
XACC
  Top 0.152: U901.5 12.7,2.81 C905.1 12.7,3.05 15.82,3.05 U902.3
XTAL1
  Top 0.152: C462.2 Y401.3 36.02,2.94 U401.62
XTAL2
  Top 0.152: U401.61 arc-90 35.56,5.03 35.56,2.29 34.91,1.64 Y401.1 C461.2
YACC  (via drill 0.33)
  Top 0.152: U901.4 9.64,1.12 C904.1 v13.72,1.02 | v17.53,2.29 17.5,2.26 U902.4
  Bottom 0.152: v13.72,1.02 14.99,2.29 v17.53,2.29
ZACC  (via drill 0.33)
  Top 0.152: U901.16 5.94,2.81 C916.1 5.84,1.52 v6.86,1.52 | v11.43,3.56 15.82,3.56 U902.6
  Bottom 0.152: v6.86,1.52 11.43,1.52 v11.43,3.56

### Text on the board
tPlace: stkwans.blogspot.com | 3V3 | SDA | SCL | BSL | GND | RX0 | TX0 | VBUS | Compass | Baro | - | + | Acc/Gyro | v2.0 15 May 2013 | HighAcc
bPlace: 3V3 | SDA | SCL | BSL | GND | RX0 | TX0 | VBUS | Boot | Reset | St Kwan's Home for | the Terminally ADD | a division of | On | Kwan Systems | RocketometerMPU6050
bDocu: D